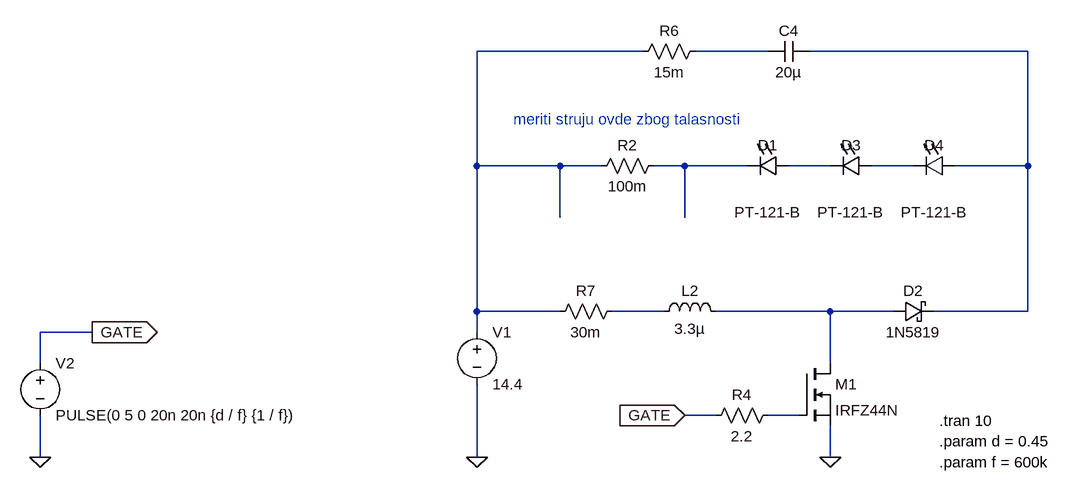
[diagram p0: schematic floating_buck_boost_LED_driver.asc]
floating_buck_boost_LED_driver.asc, the LTspice schematic file:
Version 4
SHEET 1 2200 868
WIRE 496 -336 240 -336
WIRE 688 -336 576 -336
WIRE 1088 -336 752 -336
WIRE 240 -160 240 -336
WIRE 368 -160 240 -160
WIRE 432 -160 368 -160
WIRE 560 -160 512 -160
WIRE 656 -160 560 -160
WIRE 784 -160 720 -160
WIRE 912 -160 848 -160
WIRE 1088 -160 1088 -336
WIRE 1088 -160 976 -160
WIRE 368 -80 368 -160
WIRE 560 -80 560 -160
WIRE 240 64 240 -160
WIRE 368 64 240 64
WIRE 528 64 448 64
WIRE 784 64 608 64
WIRE 880 64 784 64
WIRE 1088 64 1088 -160
WIRE 1088 64 944 64
WIRE -352 96 -432 96
WIRE 240 96 240 64
WIRE -432 144 -432 96
WIRE 784 144 784 64
WIRE 608 224 560 224
WIRE 736 224 688 224
WIRE -432 288 -432 224
WIRE 240 288 240 176
WIRE 784 288 784 240
FLAG 240 288 0
FLAG 784 288 0
FLAG 560 224 GATE
IOPIN 560 224 In
FLAG -352 96 GATE
IOPIN -352 96 Out
FLAG -432 288 0
SYMBOL voltage 240 80 R0
WINDOW 123 0 0 Left 0
WINDOW 39 0 0 Left 0
SYMATTR InstName V1
SYMATTR Value 14.4
SYMBOL ind 512 80 R270
WINDOW 0 32 56 VTop 2
WINDOW 3 5 56 VBottom 2
SYMATTR InstName L2
SYMATTR Value 3.3µ
SYMBOL res 704 208 R90
WINDOW 0 0 56 VBottom 2
WINDOW 3 32 56 VTop 2
SYMATTR InstName R4
SYMATTR Value 2.2
SYMBOL voltage -432 128 R0
WINDOW 123 0 0 Left 0
WINDOW 39 0 0 Left 0
SYMATTR InstName V2
SYMATTR Value PULSE(0 5 0 20n 20n {d / f} {1 / f})
SYMBOL cap 752 -352 R90
WINDOW 0 0 32 VBottom 2
WINDOW 3 32 32 VTop 2
SYMATTR InstName C4
SYMATTR Value 20µ
SYMBOL res 592 -352 R90
WINDOW 0 0 56 VBottom 2
WINDOW 3 32 56 VTop 2
SYMATTR InstName R6
SYMATTR Value 15m
SYMBOL LED 720 -176 R90
WINDOW 0 0 32 VBottom 2
WINDOW 3 72 32 VTop 2
SYMATTR InstName D1
SYMATTR Value PT-121-B
SYMATTR Description Diode
SYMATTR Type diode
SYMBOL res 528 -176 R90
WINDOW 0 0 56 VBottom 2
WINDOW 3 32 56 VTop 2
SYMATTR InstName R2
SYMATTR Value 100m
SYMBOL res 464 48 R90
WINDOW 0 0 56 VBottom 2
WINDOW 3 32 56 VTop 2
SYMATTR InstName R7
SYMATTR Value 30m
SYMBOL nmos 736 144 R0
SYMATTR InstName M1
SYMATTR Value IRFZ44N
SYMBOL schottky 880 80 R270
WINDOW 0 32 32 VTop 2
WINDOW 3 0 32 VBottom 2
SYMATTR InstName D2
SYMATTR Value 1N5819
SYMATTR Description Diode
SYMATTR Type diode
SYMBOL LED 848 -176 R90
WINDOW 0 0 32 VBottom 2
WINDOW 3 72 32 VTop 2
SYMATTR InstName D3
SYMATTR Value PT-121-B
SYMATTR Description Diode
SYMATTR Type diode
SYMBOL LED 976 -176 R90
WINDOW 0 0 32 VBottom 2
WINDOW 3 72 32 VTop 2
SYMATTR InstName D4
SYMATTR Value PT-121-B
SYMATTR Description Diode
SYMATTR Type diode
TEXT 952 232 Left 2 !.tran 10
TEXT 952 264 Left 2 !.param d = 0.45
TEXT 952 296 Left 2 !.param f = 600k
TEXT 296 -232 Left 2 ;meriti struju ovde zbog talasnosti

The netlist it stands for:
* floating_buck_boost_LED_driver.asc
V1 N001 0 14.4
L2 N007 N008 3.3µ
R4 N009 GATE 2.2
V2 GATE 0 PULSE(0 5 0 20n 20n {d / f} {1 / f})
C4 N003 N002 20µ
R6 N002 N001 15m
D1 N005 N004 PT-121-B
R2 N004 N001 100m
R7 N007 N001 30m
M1 N008 N009 0 0 IRFZ44N
D2 N008 N003 1N5819
D3 N006 N005 PT-121-B
D4 N003 N006 PT-121-B
.model D D
.lib standard.dio
.model NMOS NMOS
.model PMOS PMOS
.lib standard.mos
.tran 10
.param d = 0.45
.param f = 600k
* meriti struju ovde zbog talasnosti
.backanno
.end